# EAGLE design PCB-RPIBO1_HDMIEXT (EAGLE 6.5.0)

## Sheet 1 of 2
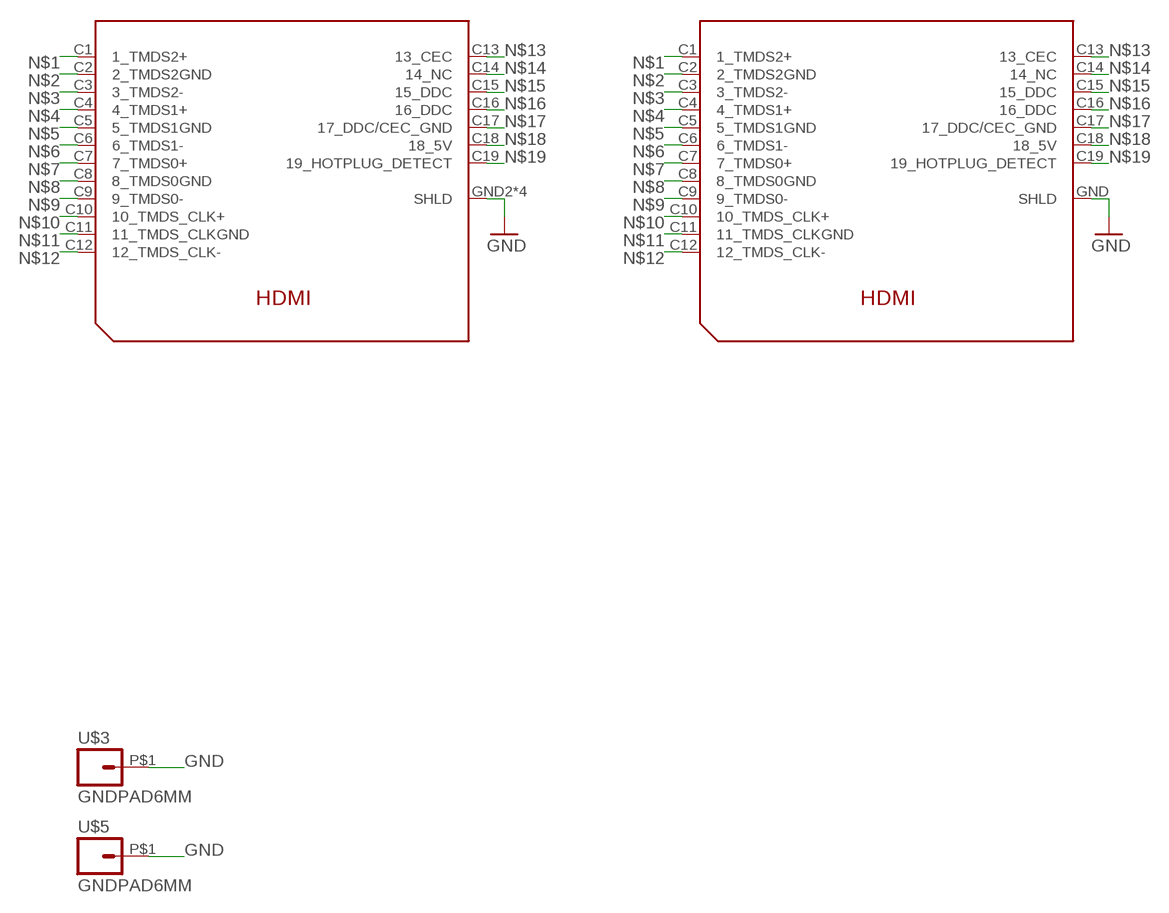
[diagram p0: schematic, sheet 1]

### Parts
U$1  HDMI  [HDMI]
U$2  HDMIPCBMALECON  [HDMI_MALEINTERCON]
U$3  GNDPAD6MM  [3.2MMPAD6MM]
U$5  GNDPAD6MM  [3.2MMPAD6MM]

### Nets
GND [Power]: U$1.GND2(SHLD) U$1.GND3(SHLD) U$1.P$2(SHLD) U$1.P$3(SHLD) U$2.GND(SHLD) U$3.P$1 U$5.P$1
N$1: U$1.C1(1_TMDS2+) U$2.C1(1_TMDS2+)
N$2: U$1.C2(2_TMDS2GND) U$2.C2(2_TMDS2GND)
N$3: U$1.C3(3_TMDS2-) U$2.C3(3_TMDS2-)
N$4: U$1.C4(4_TMDS1+) U$2.C4(4_TMDS1+)
N$5: U$1.C5(5_TMDS1GND) U$2.C5(5_TMDS1GND)
N$6: U$1.C6(6_TMDS1-) U$2.C6(6_TMDS1-)
N$7: U$1.C7(7_TMDS0+) U$2.C7(7_TMDS0+)
N$8: U$1.C8(8_TMDS0GND) U$2.C8(8_TMDS0GND)
N$9: U$1.C9(9_TMDS0-) U$2.C9(9_TMDS0-)
N$10: U$1.C10(10_TMDS_CLK+) U$2.C10(10_TMDS_CLK+)
N$11: U$1.C11(11_TMDS_CLKGND) U$2.C11(11_TMDS_CLKGND)
N$12: U$1.C12(12_TMDS_CLK-) U$2.C12(12_TMDS_CLK-)
N$13: U$1.C13(13_CEC) U$2.C13(13_CEC)
N$14: U$1.C14(14_NC) U$2.C14(14_NC)
N$15: U$1.C15(15_DDC) U$2.C15(15_DDC)
N$16: U$1.C16(16_DDC) U$2.C16(16_DDC)
N$17: U$1.C17(17_DDC/CEC_GND) U$2.C17(17_DDC/CEC_GND)
N$18: U$1.C18(18_5V) U$2.C18(18_5V)
N$19: U$1.C19(19_HOTPLUG_DETECT) U$2.C19(19_HOTPLUG_DETECT)

## Sheet 2 of 2

## Library data of the parts
U$1 U$2 = SKAARHOJ:HDMI
U$3 U$5 = SKAARHOJ:GNDPAD

## Net classes
0 default: width 0.203 mm, clearance 0.152 mm
1 Power: width 0.203 mm, clearance 0.152 mm

## Board
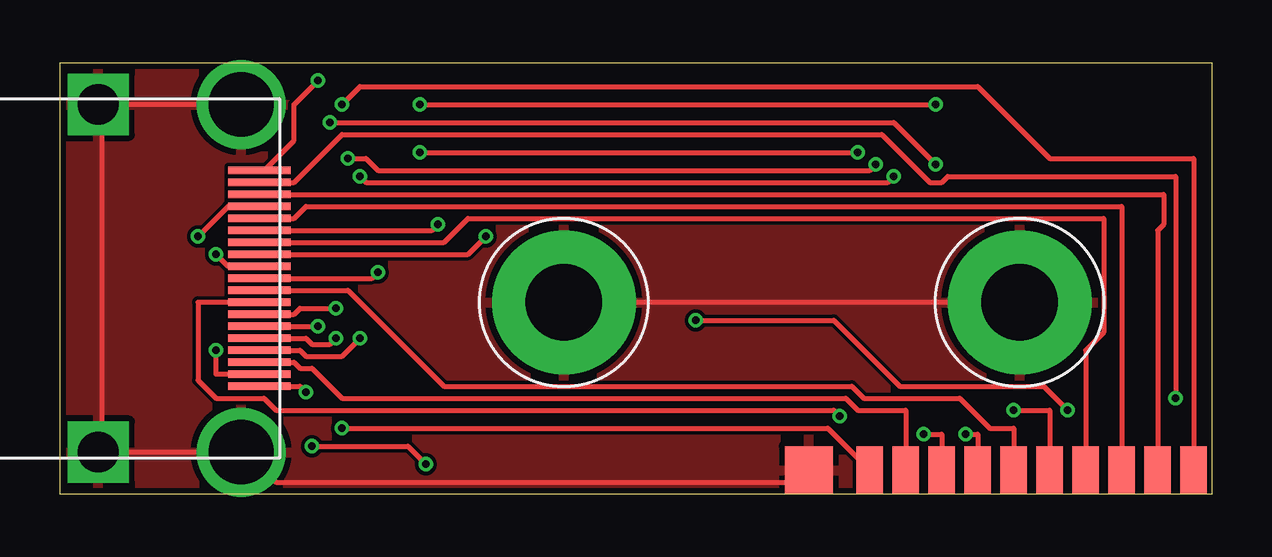
[diagram p1: board, top side]
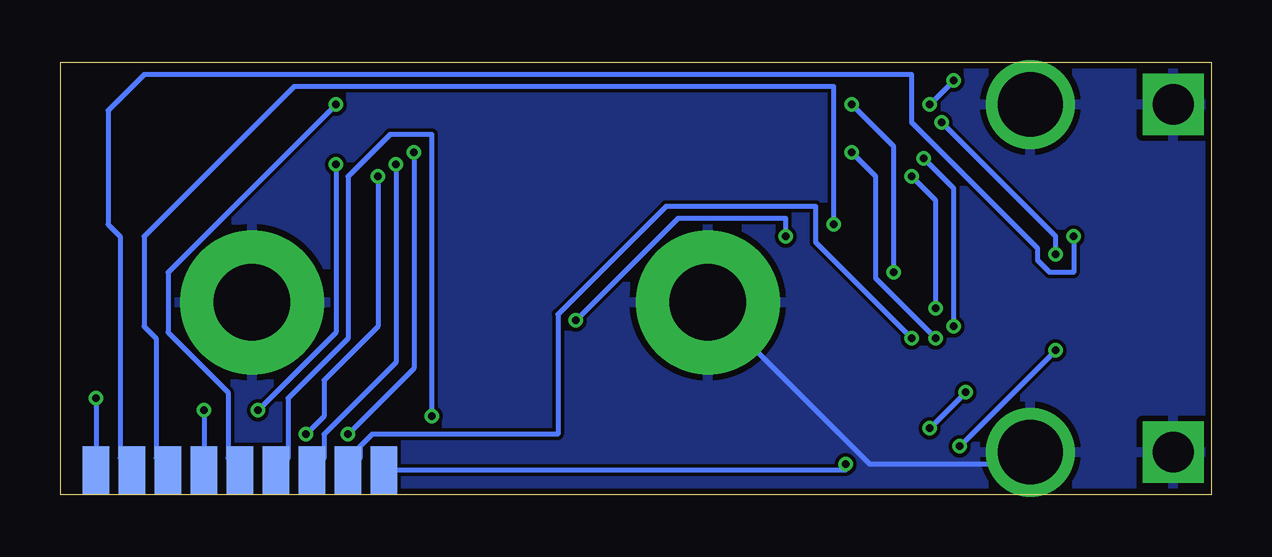
[diagram p2: board, bottom side, seen from below]

Size 48 x 18 mm. Coordinates in mm from the lower left corner, seen from the top.
Outline: 0,0 0,18 48,18 48,0 0,0
Copper layers (1*16): Top 0.035mm / dielectric 1.5mm / Bottom 0.035mm
Design rules "Fusion_eagle_rule_v1.1": minimum track width 6mil, minimum drill 12mil, track to track 6mil, track to pad 6mil, pad to pad 6mil, via to via 6mil, smd to smd 0mil, copper to edge 10mil, drill to drill 10mil, minimum pad ring 10mil, minimum via ring 6mil, stop-mask expansion 2mil, vias tented up to drill 100mil, thermal gap 10mil

### Footprints (pad centres in the part's own frame; a part is rotated, then mirrored left to right if it is on the bottom)
HDMI = smd 0.3 x 2.6: C1 4.5,10.31; C2 4,10.31; C3 3.5,10.31; C4 3,10.31; C5 2.5,10.31; C6 2,10.31; C7 1.5,10.31; C8 1,10.31; C9 0.5,10.31; C10 0,10.31; C11 -0.5,10.31; C12 -1,10.31; C13 -1.5,10.31; C14 -2,10.31; C15 -2.5,10.31; C16 -3,10.31; C17 -3.5,10.31; C18 -4,10.31; C19 -4.5,10.31 | drill 1.7 pad 2.3 square: GND2 7.25,3.59; GND3 -7.25,3.59 | drill 2.7 pad 3.3: P$2 7.25,9.55; P$3 -7.25,9.55
HDMI_MALEINTERCON = smd 1.1 x 2: C1 -6.75,1; C3 -5.25,1; C5 -3.75,1; C7 -2.25,1; C9 -0.75,1; C11 0.75,1; C13 2.25,1; C15 3.75,1; C17 5.25,1; C19 6.75,1 | smd 1.1 x 2 bottom: C2 -6,1; C4 -4.5,1; C6 -3,1; C8 -1.5,1; C10 0,1; C12 1.5,1; C14 3,1; C16 4.5,1; C18 6,1 | smd 2 x 2: GND -9.29,1
3.2MMPAD6MM = drill 3.2 pad 6: P$1 0,0

### Placement (x,y rotation side)
U$1  -2,9 270 top
U$2  40.5,0 0 top
U$3  21,8 0 top
U$5  40,8 0 top

### Tracks (layer width: path | path; a pad name or v marks a point on that pad's centre or on a via)
GND
  Top 0.203: U$5.P$1 U$3.P$1 | U$1.P$3 1.75,16.25 | U$2.GND 31,1 30.5,0.5 9,0.5 7.75,1.75 U$1.P$2 1.75,1.75 | 1.75,1.75 1.75,16.25 | 1.75,16.25 U$1.GND3 | 1.75,1.75 U$1.GND2
  Bottom 0.203: U$3.P$1 14.25,1.25 7.75,1.25 7.75,1.75 U$1.P$2
  pour Top: 0,0 48,0 48,18 0,18
  pour Bottom: 0,0 48,0 48,18 0,18
N$1  (via drill 0.3)
  Top 0.203: U$2.C1 32,2.75 v11.75,2.75 | v10.25,4.25 10,4.5 U$1.C1
  Bottom 0.203: v10.25,4.25 v11.75,2.75
N$2  (via drill 0.3)
  Top 0.203: v15.25,1.25 14.5,2 v10.5,2 | v6.5,6 6.5,5 U$1.C2
  Bottom 0.203: U$2.C2 15.25,1 v15.25,1.25 | v6.5,6 v10.5,2
N$3
  Top 0.203: U$2.C3 35.25,3.5 33.25,3.5 32.75,4 11.75,4 10.5,5.25 10,5.25 9.75,5.5 U$1.C3
N$4  (via drill 0.3)
  Top 0.203: v12.5,6.5 11.75,5.75 10.25,5.75 10,6 U$1.C4
  Bottom 0.203: U$2.C4 35.5,1.5 35.5,2 35,2.5 27.25,2.5 27.25,7.5 22.75,12 16.5,12 16.5,10.5 v12.5,6.5
N$5  (via drill 0.3)
  Top 0.203: U$2.C5 36.75,2.5 v36,2.5 | v15,14.25 v33.25,14.25 | v11.5,6.5 11.25,6.25 10.5,6.25 10.25,6.5 U$1.C5
  Bottom 0.203: v36,2.5 33.25,5.25 v33.25,14.25 | v15,14.25 14,13.25 14,9 v11.5,6.5
N$6  (via drill 0.3)
  Top 0.203: v34,13.75 33.75,13.5 13.25,13.5 12.75,14 v12,14 | U$1.C6 v10.75,7
  Bottom 0.203: U$2.C6 37,1.5 37,2.5 34,5.5 v34,13.75 | v12,14 10.75,12.75 v10.75,7
N$7  (via drill 0.3)
  Top 0.203: U$2.C7 38.25,2.5 v37.75,2.5 | v34.75,13.25 34.5,13 12.75,13 v12.5,13.25 | v11.5,7.75 10,7.75 9.75,7.5 U$1.C7
  Bottom 0.203: v37.75,2.5 37,3.25 37,4.75 34.75,7 v34.75,13.25 | v12.5,13.25 11.5,12.25 v11.5,7.75
N$8  (via drill 0.3)
  Top 0.203: v32.5,3.25 32.25,3.5 9,3.5 8.5,4 6.5,4 5.75,4.75 5.75,8 U$1.C8
  Bottom 0.203: U$2.C8 38.5,1.5 38.5,4 36,6.5 36,13.25 34.25,15 32.5,15 v32.5,3.25
N$9
  Top 0.203: U$2.C9 39.75,2.75 38.75,2.75 37.5,4 33.5,4 33,4.5 16,4.5 12,8.5 U$1.C9
N$10  (via drill 0.3)
  Top 0.203: v15,16.25 v36.5,16.25 | v13.25,9.25 13,9 U$1.C10
  Bottom 0.203: U$2.C10 41,1.5 41,4.25 43.5,6.75 43.5,9.25 v36.5,16.25 | v15,16.25 13.25,14.5 v13.25,9.25
N$11  (via drill 0.3)
  Top 0.203: U$2.C11 41.25,3.5 v39.75,3.5 | v36.5,13.75 34.75,15.5 v11.25,15.5 | v6.5,10 7,9.5 U$1.C11
  Bottom 0.203: v39.75,3.5 36.5,6.75 v36.5,13.75 | v11.25,15.5 6.5,10.75 v6.5,10
N$12  (via drill 0.3)
  Top 0.203: v42,3.5 41,4.5 35,4.5 32.25,7.25 v26.5,7.25 | v17.75,10.75 17,10 U$1.C12
  Bottom 0.203: v42,3.5 U$2.C12 | v26.5,7.25 22.25,11.5 17.75,11.5 v17.75,10.75
N$13
  Top 0.203: U$2.C13 42.75,6 43.5,6.75 43.5,11.5 17,11.5 16,10.5 U$1.C13
N$14  (via drill 0.3)
  Top 0.203: v15.75,11.25 15.5,11 U$1.C14
  Bottom 0.203: U$2.C14 44,1.5 44,6.5 44.5,7 44.5,10.75 38.25,17 15.75,17 v15.75,11.25
N$15
  Top 0.203: U$2.C15 44.25,12 10.25,12 9.75,11.5 U$1.C15
N$16  (via drill 0.3)
  Top 0.203: v5.75,10.75 7,12 U$1.C16
  Bottom 0.203: U$2.C16 45.5,1.5 45.5,10.75 46,11.25 46,16 44.5,17.5 12.5,17.5 12.5,15.5 7.25,10.25 7.25,9.75 6.75,9.25 5.75,9.25 v5.75,10.75
N$17
  Top 0.203: U$2.C17 45.75,11 46,11.25 46,12.5 U$1.C17
N$18  (via drill 0.3)
  Top 0.203: v46.5,4 46.5,13.25 37,13.25 36.75,13 36.25,13 34.25,15 11.75,15 9.75,13 U$1.C18
  Bottom 0.203: v46.5,4 U$2.C18
N$19  (via drill 0.3)
  Top 0.203: U$2.C19 47.25,14 41.25,14 38.25,17 12.5,17 v11.75,16.25 | v10.75,17.25 9.75,16.25 9.75,14.75 8.5,13.5 U$1.C19
  Bottom 0.203: v10.75,17.25 v11.75,16.25